# EAGLE design amp_ins (EAGLE 9.6.2)
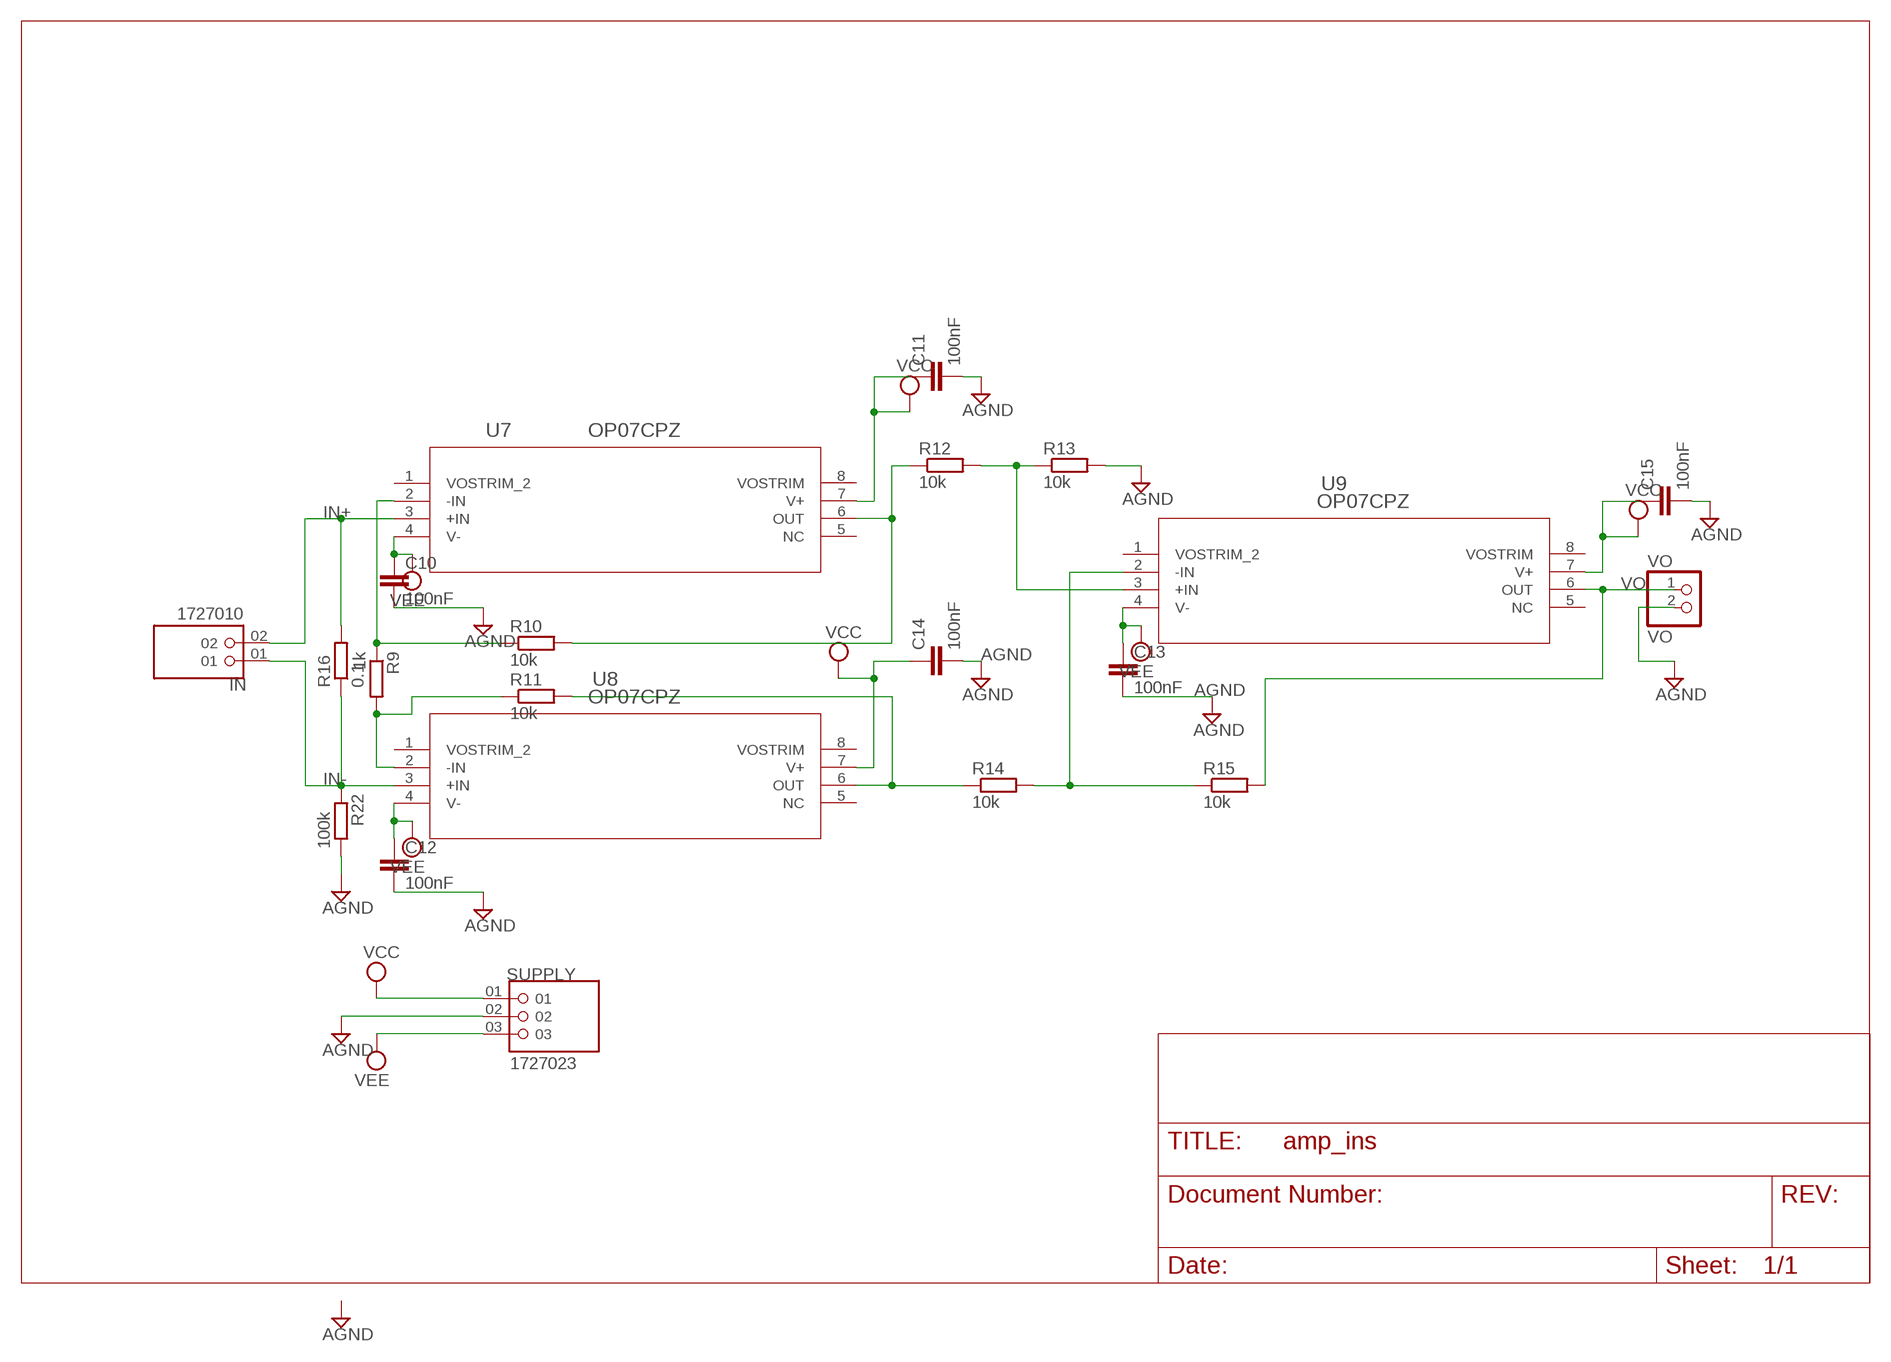
[diagram p0: schematic, sheet 1]

## Parts
C10  100nF  C-EU075-042X103  [C075-042X103]
C11  100nF  C-EU075-042X103  [C075-042X103]
C12  100nF  C-EU075-042X103  [C075-042X103]
C13  100nF  C-EU075-042X103  [C075-042X103]
C14  100nF  C-EU075-042X103  [C075-042X103]
C15  100nF  C-EU075-042X103  [C075-042X103]
IN  1727010  [PHOENIX_1727010]
R9  1k  R-EU_0207/10  [0207/10]
R10  10k  R-EU_0207/10  [0207/10]
R11  10k  R-EU_0207/10  [0207/10]
R12  10k  R-EU_0207/10  [0207/10]
R13  10k  R-EU_0207/10  [0207/10]
R14  10k  R-EU_0207/10  [0207/10]
R15  10k  R-EU_0207/10  [0207/10]
R16  0.1  R-EU_0617/17  [0617/17]
R22  100k  R-EU_0207/10  [0207/10]
SUPPLY  1727023  [PHOENIX_1727023]
U7  OP07CPZ  [N_8_ADI]
U8  OP07CPZ  [N_8_ADI]
U9  OP07CPZ  [N_8_ADI]
VO  VO  PINHD-1X2  [1X02]

## Nets
AGND [high_current]: C10.2 C11.2 C12.2 C13.2 C14.2 C15.2 R13.2 R22.2 SUPPLY.02 VO.2
IN+ [high_current]: IN.02 R16.2 U7.3(+IN)
IN- [high_current]: IN.01 R16.1 R22.1 U8.3(+IN)
N$8: R9.1 R10.1 U7.2(-IN)
N$9: R9.2 R11.1 U8.2(-IN)
N$10: R11.2 R14.1 U8.6(OUT)
N$11: R10.2 R12.1 U7.6(OUT)
N$12: R12.2 R13.1 U9.3(+IN)
N$14: R14.2 R15.1 U9.2(-IN)
VCC [high_current]: C11.1 C14.1 C15.1 SUPPLY.01 U7.7(V+) U8.7(V+) U9.7(V+)
VEE [high_current]: C10.1 C12.1 C13.1 SUPPLY.03 U7.4(V-) U8.4(V-) U9.4(V-)
VO [high_current]: R15.2 U9.6(OUT) VO.1
Unconnected: U7.1(VOSTRIM_2) U7.5(NC) U7.8(VOSTRIM) U8.1(VOSTRIM_2) U8.5(NC) U8.8(VOSTRIM) U9.1(VOSTRIM_2) U9.5(NC) U9.8(VOSTRIM)

## Library data of the parts
C10-C15 = rcl:C-EU: CAPACITOR, European symbol; SPICEPREFIX: C
IN = 1727010:1727010; MANUFACTURER: Phoenix Contact; PARTREV: 03.03.2021; STANDARD: Manufacturer Recommendations
R9-R16 R22 = rcl:R-EU_: RESISTOR, European symbol; SPICEPREFIX: R
SUPPLY = 1727023:1727023; MANUFACTURER: Phoenix Contact; PARTREV: 03.03.2021; STANDARD: Manufacturer Recommendations
U7-U9 = OP07:OP07CPZ; COPYRIGHT: Copyright (C) 2024 Ultra Librarian. All rights reserved.; MANUFACTURER_PART_NUMBER: OP07CPZ; MFR_NAME: Analog Devices Inc
VO = pinhead:PINHD-1X2: PIN HEADER

## Net classes
1 high_current: width 0.305 mm, drill 0.305 mm, clearance 0.305 mm

## Board
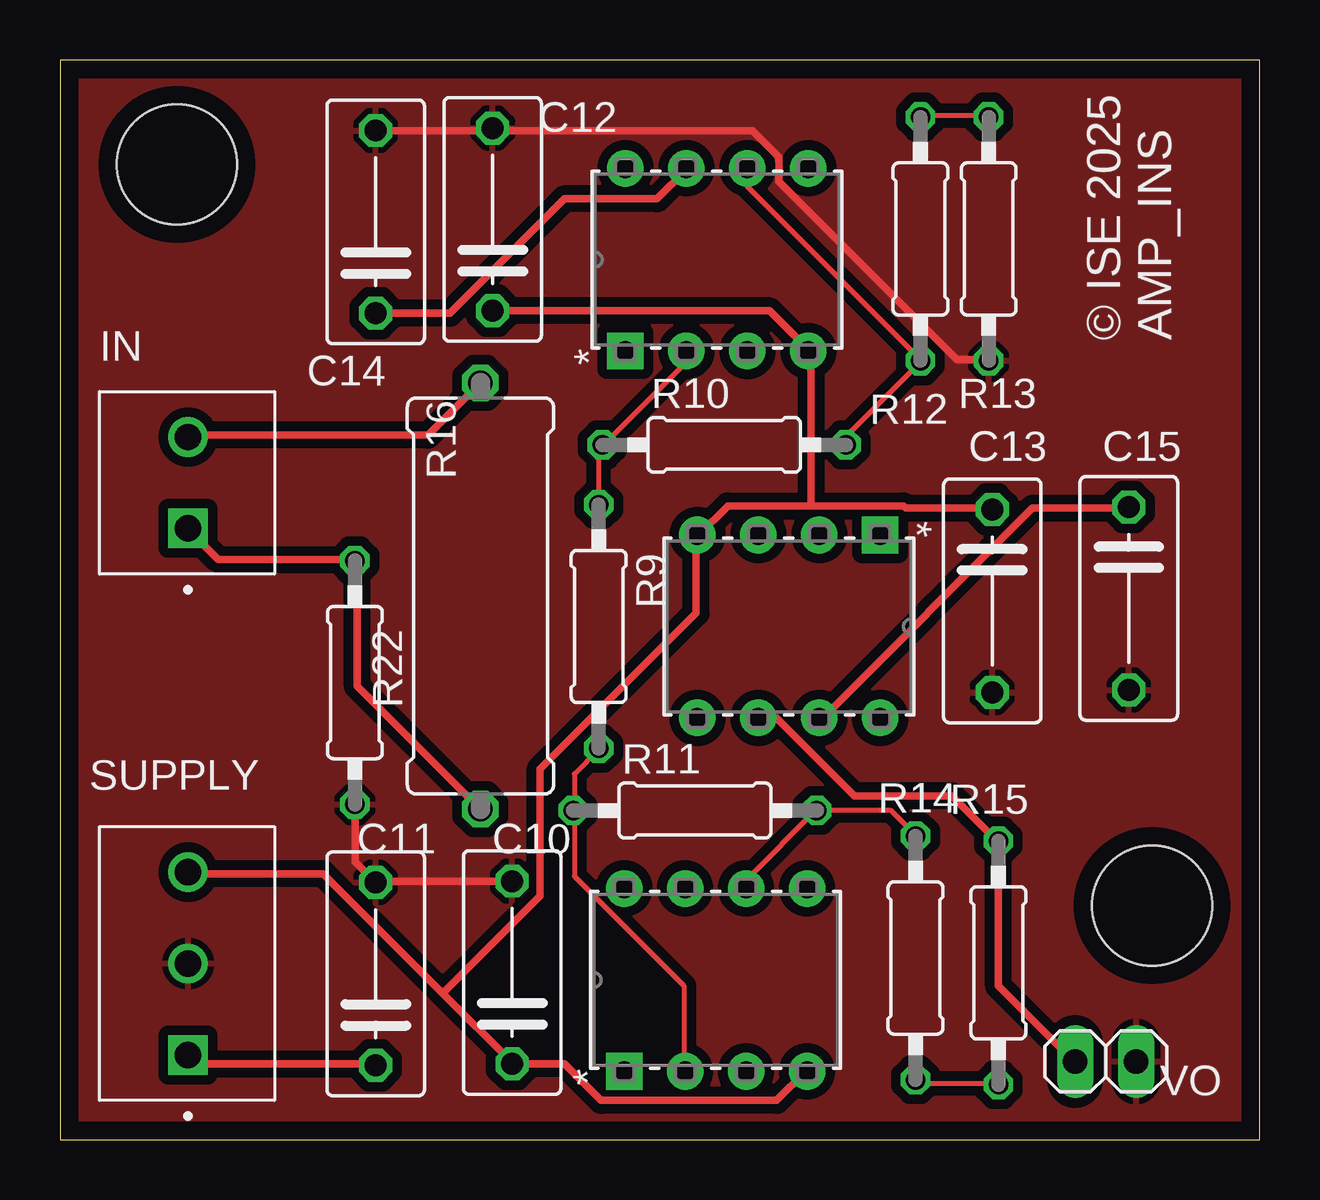
[diagram p1: board, top side]
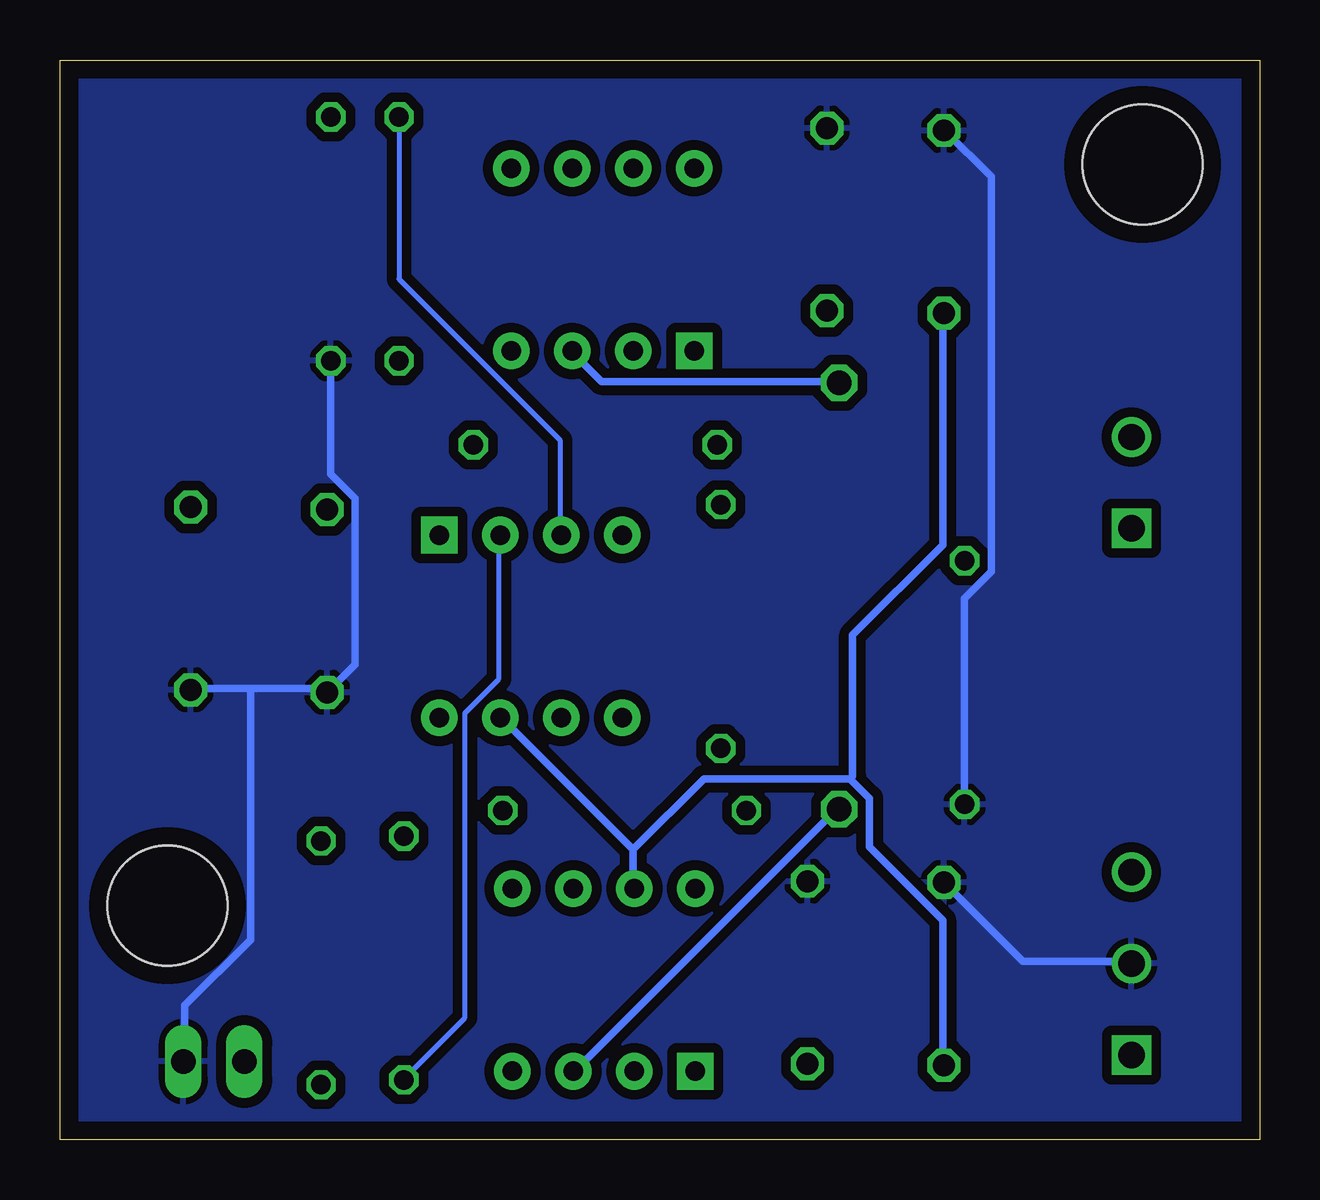
[diagram p2: board, bottom side, seen from below]

Size 50 x 45 mm. Coordinates in mm from the lower left corner, seen from the top.
Outline: 0,0 50,0 50,45 0,45 0,0
Copper layers (1*16): Top 0.035mm / dielectric 1.6mm / Bottom 0.035mm
Design rules "Eagle_9_5_DRU_median_rules_8mils_trace_space": minimum track width 8mil, minimum drill 12mil, track to track 8mil, track to pad 8mil, pad to pad 8mil, via to via 8mil, smd to smd 6mil, copper to edge 30mil, drill to drill 10mil, minimum pad ring 8mil, minimum via ring 6mil, stop-mask expansion 0mil, vias tented up to drill 100mil, thermal gap 10mil
Holes 5 mm at 4.88,40.64 45.52,9.75

### Footprints (pad centres in the part's own frame; a part is rotated, then mirrored left to right if it is on the bottom)
C075-042X103 = drill 0.914 octagon: 1 -3.81,0; 2 3.81,0
PHOENIX_1727010 = drill 1.1 pad 1.65 square: 01 1.9,3.6 | drill 1.1 pad 1.65: 02 5.71,3.6
0207/10 = drill 0.813 octagon: 1 -5.08,0; 2 5.08,0
0617/17 = drill 1.016 octagon: 1 -8.89,0; 2 8.89,0
PHOENIX_1727023 = drill 1.1 pad 1.65 square: 01 1.9,3.6 | drill 1.1 pad 1.65: 02 5.71,3.6; 03 9.52,3.6
N_8_ADI = drill 0.813 pad 1.524 square: 1 0,0 | drill 0.813 pad 1.524: 2 0,-2.54; 3 0,-5.08; 4 0,-7.62; 5 7.62,-7.62; 6 7.62,-5.08; 7 7.62,-2.54; 8 7.62,0
1X02 = drill 1.016 long: 1 -1.27,0; 2 1.27,0

### Placement (x,y rotation side)
C10  18.85,6.96 90 top
C11  13.16,6.91 90 top
C12  18.03,38.35 90 top
C13  38.86,22.45 270 top
C14  13.16,38.25 90 top
C15  44.55,22.56 270 top
IN  8.94,23.57 90 top
R9  22.45,21.39 270 top
R10  27.69,28.96 0 top
R11  26.47,13.72 0 top
R12  35.86,37.54 90 top
R13  38.71,37.54 270 top
R14  35.66,7.57 270 top
R15  39.12,7.37 90 top
R16  17.53,22.66 90 top
R22  12.29,19.05 270 top
SUPPLY  8.94,1.63 90 top
U7  23.57,32.87 90 top
U8  23.52,2.84 90 top
U9  34.19,25.2 270 top
VO  43.59,3.25 0 top

### Tracks (layer width: path | path; a pad name or v marks a point on that pad's centre or on a via)
AGND
  Top 0.305: R22.2 12.29,11.58 C11.2 13.21,10.77 C10.2 | C14.2 17.88,42.06 17.98,42.16 C12.2 18.09,42.06 28.85,42.06 29.97,40.95 29.97,39.93 37.39,32.51 38.71,32.51 R13.2
  Bottom 0.305: C11.2 9.86,7.42 5.38,7.42 SUPPLY.02 | R13.2 38.71,27.74 37.69,26.72 37.69,19.81 C13.2 38.91,18.8 42.06,18.8 | 42.06,18.8 44.5,18.8 C15.2 | 42.06,18.8 42.06,8.33 44.81,5.59 44.81,3.25 VO.2 | R22.2 12.29,22.55 11.18,23.67 11.18,40.13 13.11,42.06 C14.2
  pour Top (isolate 0.406): 0,44.7 49.58,44.7 49.58,0 0,0
  pour Bottom (isolate 0.406): 0,44.7 49.58,44.7 49.58,0 0,0
IN+
  Top 0.305: R16.2 15.34,29.36 5.38,29.36 IN.02
  Bottom 0.305: R16.2 17.58,31.6 27.43,31.6 28.65,32.82 U7.3
IN-
  Top 0.305: IN.01 5.38,25.4 6.6,24.18 12.29,24.18 R22.1 12.39,24.08 12.39,18.9 R16.1
  Bottom 0.305: U8.3 28.55,2.85 17.58,13.82 R16.1
N$8
  Top 0.203: R9.1 22.45,28.85 22.55,28.96 R10.1 22.66,28.96 26.11,32.41 U7.2
N$9
  Top 0.203: 21.44,13.72 21.44,15.24 22.45,16.26 R9.2 | 21.44,13.72 21.44,10.97 26.01,6.4 26.01,2.85 U8.2 | 21.44,13.72 R11.1
N$10
  Top 0.203: R14.1 35.66,12.7 34.65,13.72 R11.2 31.5,13.72 28.65,10.87 28.65,10.46 U8.6
N$11
  Top 0.203: R10.2 32.82,28.96 32.82,29.36 35.87,32.41 R12.1 35.87,32.51 28.65,39.73 U7.6
N$12
  Top 0.203: R12.2 35.87,42.67 38.71,42.67 R13.1
  Bottom 0.203: R12.2 35.87,35.87 29.16,29.16 29.16,25.2 U9.3
N$14
  Top 0.203: R15.1 39.12,2.34 35.76,2.34 35.66,2.44 R14.2
  Bottom 0.203: U9.2 31.7,25.2 31.7,19.2 33.12,17.78 33.12,5.08 35.66,2.54 R14.2
VCC
  Top 0.305: C14.1 16.26,34.44 21.03,39.22 24.89,39.22 26.11,40.44 U7.7 | C11.1 13.11,3.15 5.69,3.15 5.38,3.45 SUPPLY.01 | U9.7 31.8,17.58 40.54,26.31 44.5,26.31 C15.1
  Bottom 0.305: 26.11,12.09 26.11,10.46 U8.7 | 26.11,12.09 31.6,17.58 U9.7 | 17.07,15.04 16.26,14.22 16.26,12.19 13.21,9.14 13.21,3.15 C11.1 | 17.07,15.04 23.16,15.04 26.11,12.09 | C14.1 13.21,34.44 13.21,24.79 16.97,21.03 16.97,15.14 17.07,15.04
VEE
  Top 0.305: 31.29,26.42 27.84,26.42 26.62,25.2 U9.4 26.52,25.09 26.52,21.95 20.02,15.44 20.02,10.16 15.95,6.1 | 31.29,26.42 35.15,26.42 35.26,26.31 38.81,26.31 C13.1 | C12.1 29.57,34.54 31.19,32.92 U7.4 31.29,32.82 31.29,26.42 | U8.4 31.09,2.85 29.87,1.63 22.55,1.63 21.03,3.15 C10.1 18.8,3.25 15.95,6.1 | 15.95,6.1 10.97,11.07 5.38,11.07 SUPPLY.03
VO
  Top 0.305: VO.1 42.27,3.25 39.12,6.4 R15.2 39.01,12.5 37.19,14.33 33.12,14.33 29.87,17.58 U9.6

### Text on the board
tNames: © ISE 2025 / AMP_INS